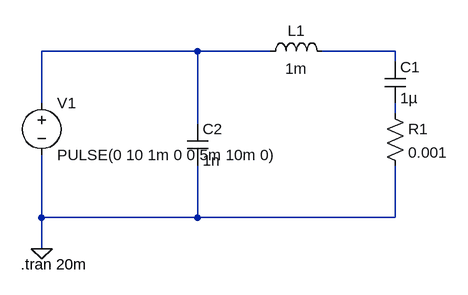
[diagram p0: schematic rc_v2.asc]
rc_v2.asc, the LTspice schematic file:
Version 4.1
SHEET 1 880 680
WIRE 192 64 -48 64
WIRE 304 64 192 64
WIRE 496 64 384 64
WIRE 496 80 496 64
WIRE -48 144 -48 64
WIRE 496 160 496 144
WIRE 192 176 192 64
WIRE -48 320 -48 224
WIRE 192 320 192 240
WIRE 192 320 -48 320
WIRE 496 320 496 240
WIRE 496 320 192 320
WIRE -48 368 -48 320
FLAG -48 368 0
SYMBOL voltage -48 128 R0
WINDOW 123 0 0 Left 0
WINDOW 39 0 0 Left 0
SYMATTR InstName V1
SYMATTR Value PULSE(0 10 1m 0 0 5m 10m 0)
SYMBOL res 480 144 R0
SYMATTR InstName R1
SYMATTR Value 0.001
SYMBOL cap 176 176 R0
SYMATTR InstName C2
SYMATTR Value 1n
SYMBOL ind 288 80 R270
WINDOW 0 32 56 VTop 2
WINDOW 3 5 56 VBottom 2
SYMATTR InstName L1
SYMATTR Value 1m
SYMBOL cap 480 80 R0
SYMATTR InstName C1
SYMATTR Value 1µ
TEXT -80 392 Left 2 !.tran 20m

The netlist it stands for:
* rc_v2.asc
V1 N001 0 PULSE(0 10 1m 0 0 5m 10m 0)
R1 N003 0 0.001
C2 N001 0 1n
L1 N001 N002 1m
C1 N002 N003 1µ
.tran 20m
.backanno
.end